# Altium schematic sheet PiPico.SchDoc
size A4; SheetNumber: 1; SheetTotal: 1
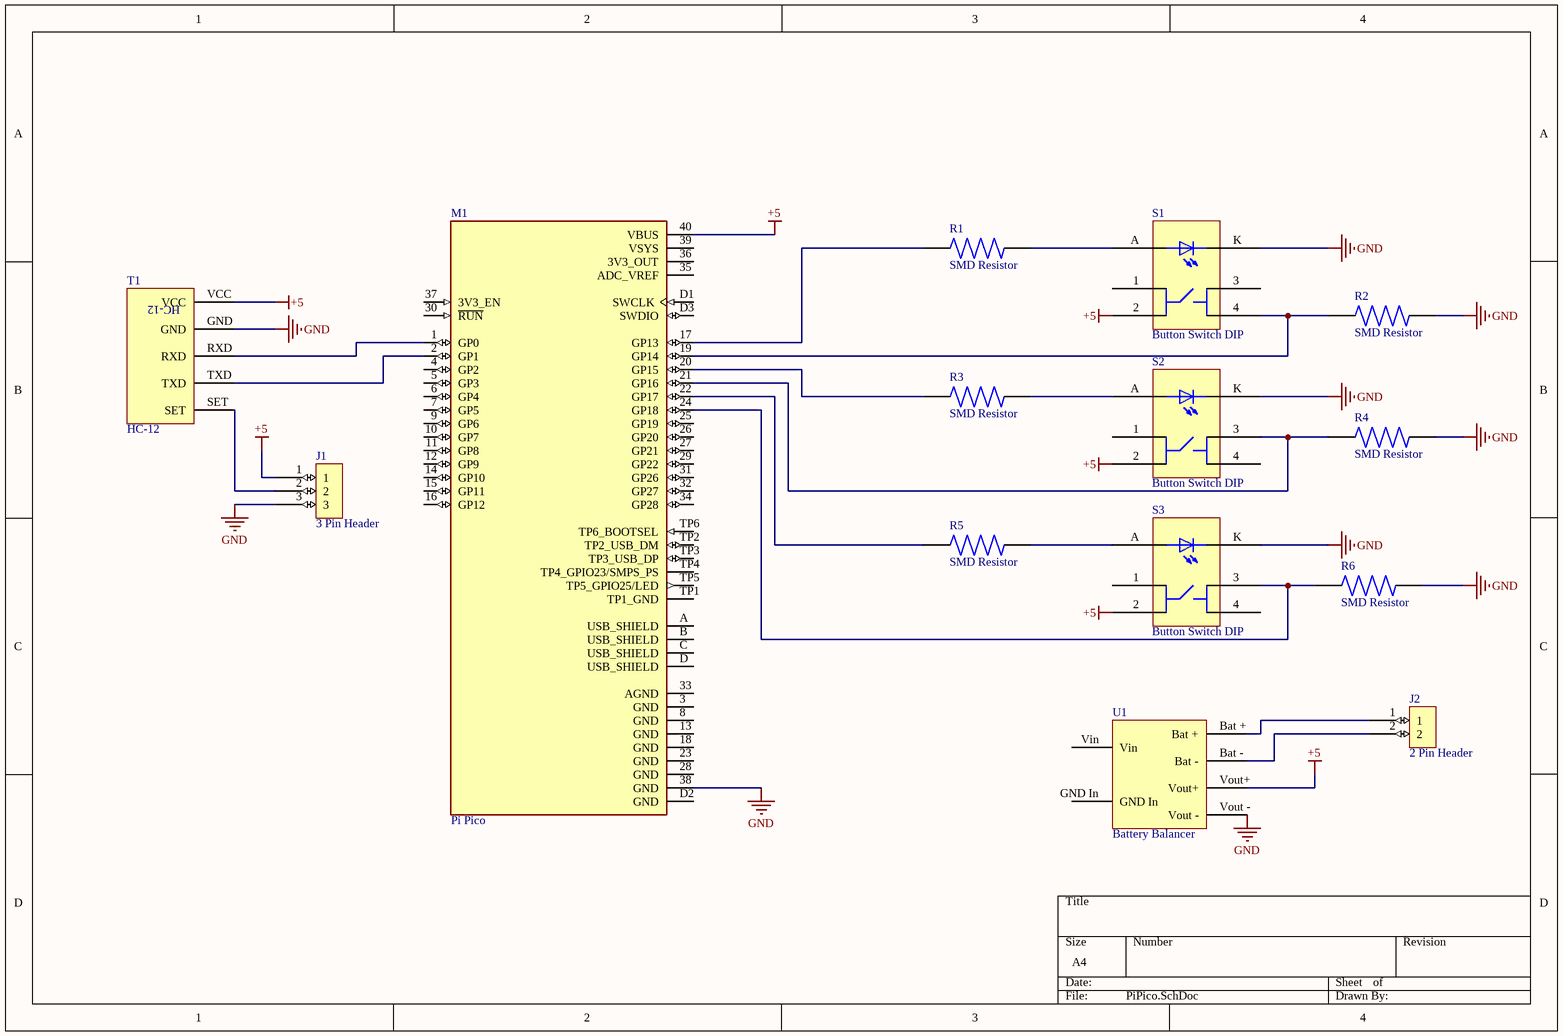
[diagram p0: PiPico.SchDoc]

## Parts
J1  3 Pin Header  [3 Pin Header-Footprint-1]
J2  2 Pin Header  [2 Pin Header-Footprint-1]
M1  Pi Pico  [Pi Pico-Footprint-1]
R1  SMD Resistor  [SMD Resistor-Footprint-1]
R2  SMD Resistor  [SMD Resistor-Footprint-1]
R3  SMD Resistor  [SMD Resistor-Footprint-1]
R4  SMD Resistor  [SMD Resistor-Footprint-1]
R5  SMD Resistor  [SMD Resistor-Footprint-1]
R6  SMD Resistor  [SMD Resistor-Footprint-1]
S1  Button Switch DIP  [Button Switch DIP -Footprint-1]
S2  Button Switch DIP  [Button Switch DIP -Footprint-1]
S3  Button Switch DIP  [Button Switch DIP -Footprint-1]
T1  HC-12  [HC-12-Footprint-1]
U1  Battery Balancer  [Battery Balancer-Footprint-1]

## Nets
+5: J1.1 M1.40(VBUS) S1.2 S2.2 S3.2 T1.VCC U1.Vout+
GND: J1.3 M1.38(GND) R2.2 R4.2 R6.2 S1.K S2.K S3.K T1.GND U1.Vout_-
NetJ1_2: J1.2 T1.SET
NetJ2_1: J2.1 U1.Bat_+
NetJ2_2: J2.2 U1.Bat_-
NetM1_1: M1.1(GP0) T1.RXD
NetM1_2: M1.2(GP1) T1.TXD
NetM1_17: M1.17(GP13) R1.1
NetM1_19: M1.19(GP14) R2.1 S1.4
NetM1_20: M1.20(GP15) R3.1
NetM1_21: M1.21(GP16) R4.1 S2.3
NetM1_22: M1.22(GP17) R5.1
NetM1_24: M1.24(GP18) R6.1 S3.3
NetR1_2: R1.2 S1.A
NetR3_2: R3.2 S2.A
NetR5_2: R5.2 S3.A

Not connected (* = marked no-connect by the designer): M1 3(GND) 4(GP2) 5(GP3) 6(GP4) 7(GP5) 8(GND) 9(GP6) 10(GP7) 11(GP8) 12(GP9) 13(GND) 14(GP10) 15(GP11) 16(GP12) 18(GND) 23(GND) 25(GP19) 26(GP20) 27(GP21) 28(GND) 29(GP22) 30(~{RUN}) 31(GP26) 32(GP27) 33(AGND) 34(GP28) 35(ADC_VREF) 36(3V3_OUT) 37(3V3_EN) 39(VSYS) A(USB_SHIELD) B(USB_SHIELD) C(USB_SHIELD) D(USB_SHIELD) D1(SWCLK) D2(GND) D3(SWDIO) TP1(TP1_GND) TP2(TP2_USB_DM) TP3(TP3_USB_DP) TP4(TP4_GPIO23/SMPS_PS) TP5(TP5_GPIO25/LED) TP6(TP6_BOOTSEL); S1 1 3; S2 1 4; S3 1 4; U1 GND In Vin

## Library data of the parts
J1 = CMP-00043-1: 3 Pin Breakout Header
J2 = CMP-00041-1: 2Pin  Breakout Header
M1 = CMP-00035-2
R1-R6 = CMP-00019-2: Generic SMD Resistor
S1-S3 = CMP-00006-1: 6 Pin with LED
T1 = CMP-00027-3: UART Telemetry Antenna
U1 = CMP-00024-2: 1Cell LiPo Battery Module